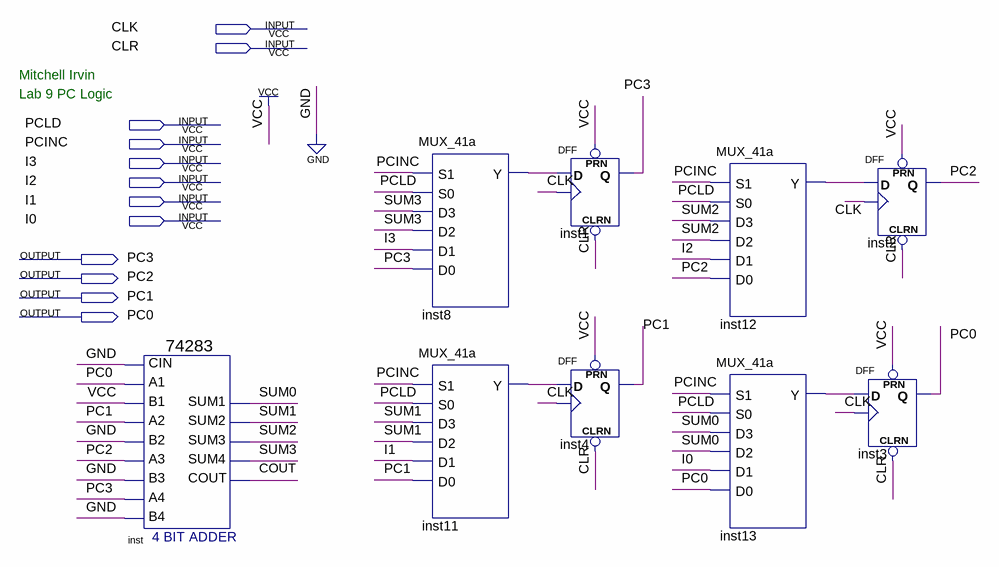
[diagram p0: schematic sheet]
// Quartus schematic PC.bdf as structural Verilog: 9 symbols, 12 pins
module PC (
  input  CLK,
  input  CLR,
  input  PCLD,
  input  PCINC,
  input  I3,
  input  I2,
  input  I1,
  input  I0,
  output PC3,
  output PC2,
  output PC1,
  output PC0
);

  wire COUT, inst8_y, inst11_y, inst12_y, inst13_y, SUM0, SUM1, SUM2, SUM3;

  \74283  inst (
    .CIN(1'b0), .A1(PC0), .A2(PC1), .B2(1'b0), .A3(PC2), .A4(PC3), .B4(1'b0), .B1(1'b1), .B3(1'b0),
    .SUM4(SUM3), .COUT(COUT), .SUM1(SUM0), .SUM2(SUM1), .SUM3(SUM2));
  MUX_41a inst8 (.S1(PCINC), .S0(PCLD), .D3(SUM3), .D2(SUM3), .D1(I3), .D0(PC3), .Y(inst8_y));
  MUX_41a inst11 (.S1(PCINC), .S0(PCLD), .D3(SUM1), .D2(SUM1), .D1(I1), .D0(PC1), .Y(inst11_y));
  DFF inst1 (.CLRN(CLR), .CLK(CLK), .D(inst8_y), .PRN(1'b1), .Q(PC3));
  DFF inst4 (.CLRN(CLR), .CLK(CLK), .D(inst11_y), .PRN(1'b1), .Q(PC1));
  MUX_41a inst12 (.S1(PCINC), .S0(PCLD), .D3(SUM2), .D2(SUM2), .D1(I2), .D0(PC2), .Y(inst12_y));
  MUX_41a inst13 (.S1(PCINC), .S0(PCLD), .D3(SUM0), .D2(SUM0), .D1(I0), .D0(PC0), .Y(inst13_y));
  DFF inst3 (.CLRN(CLR), .CLK(CLK), .D(inst13_y), .PRN(1'b1), .Q(PC0));
  DFF inst2 (.CLRN(CLR), .CLK(CLK), .D(inst12_y), .PRN(1'b1), .Q(PC2));

  // Notes on the sheet:
  //   Mitchell Irvin
  //   Lab 9 PC Logic
endmodule
